# Altium schematic sheet Top.SchDoc
size B; SheetNumber: 1; SheetTotal: 9
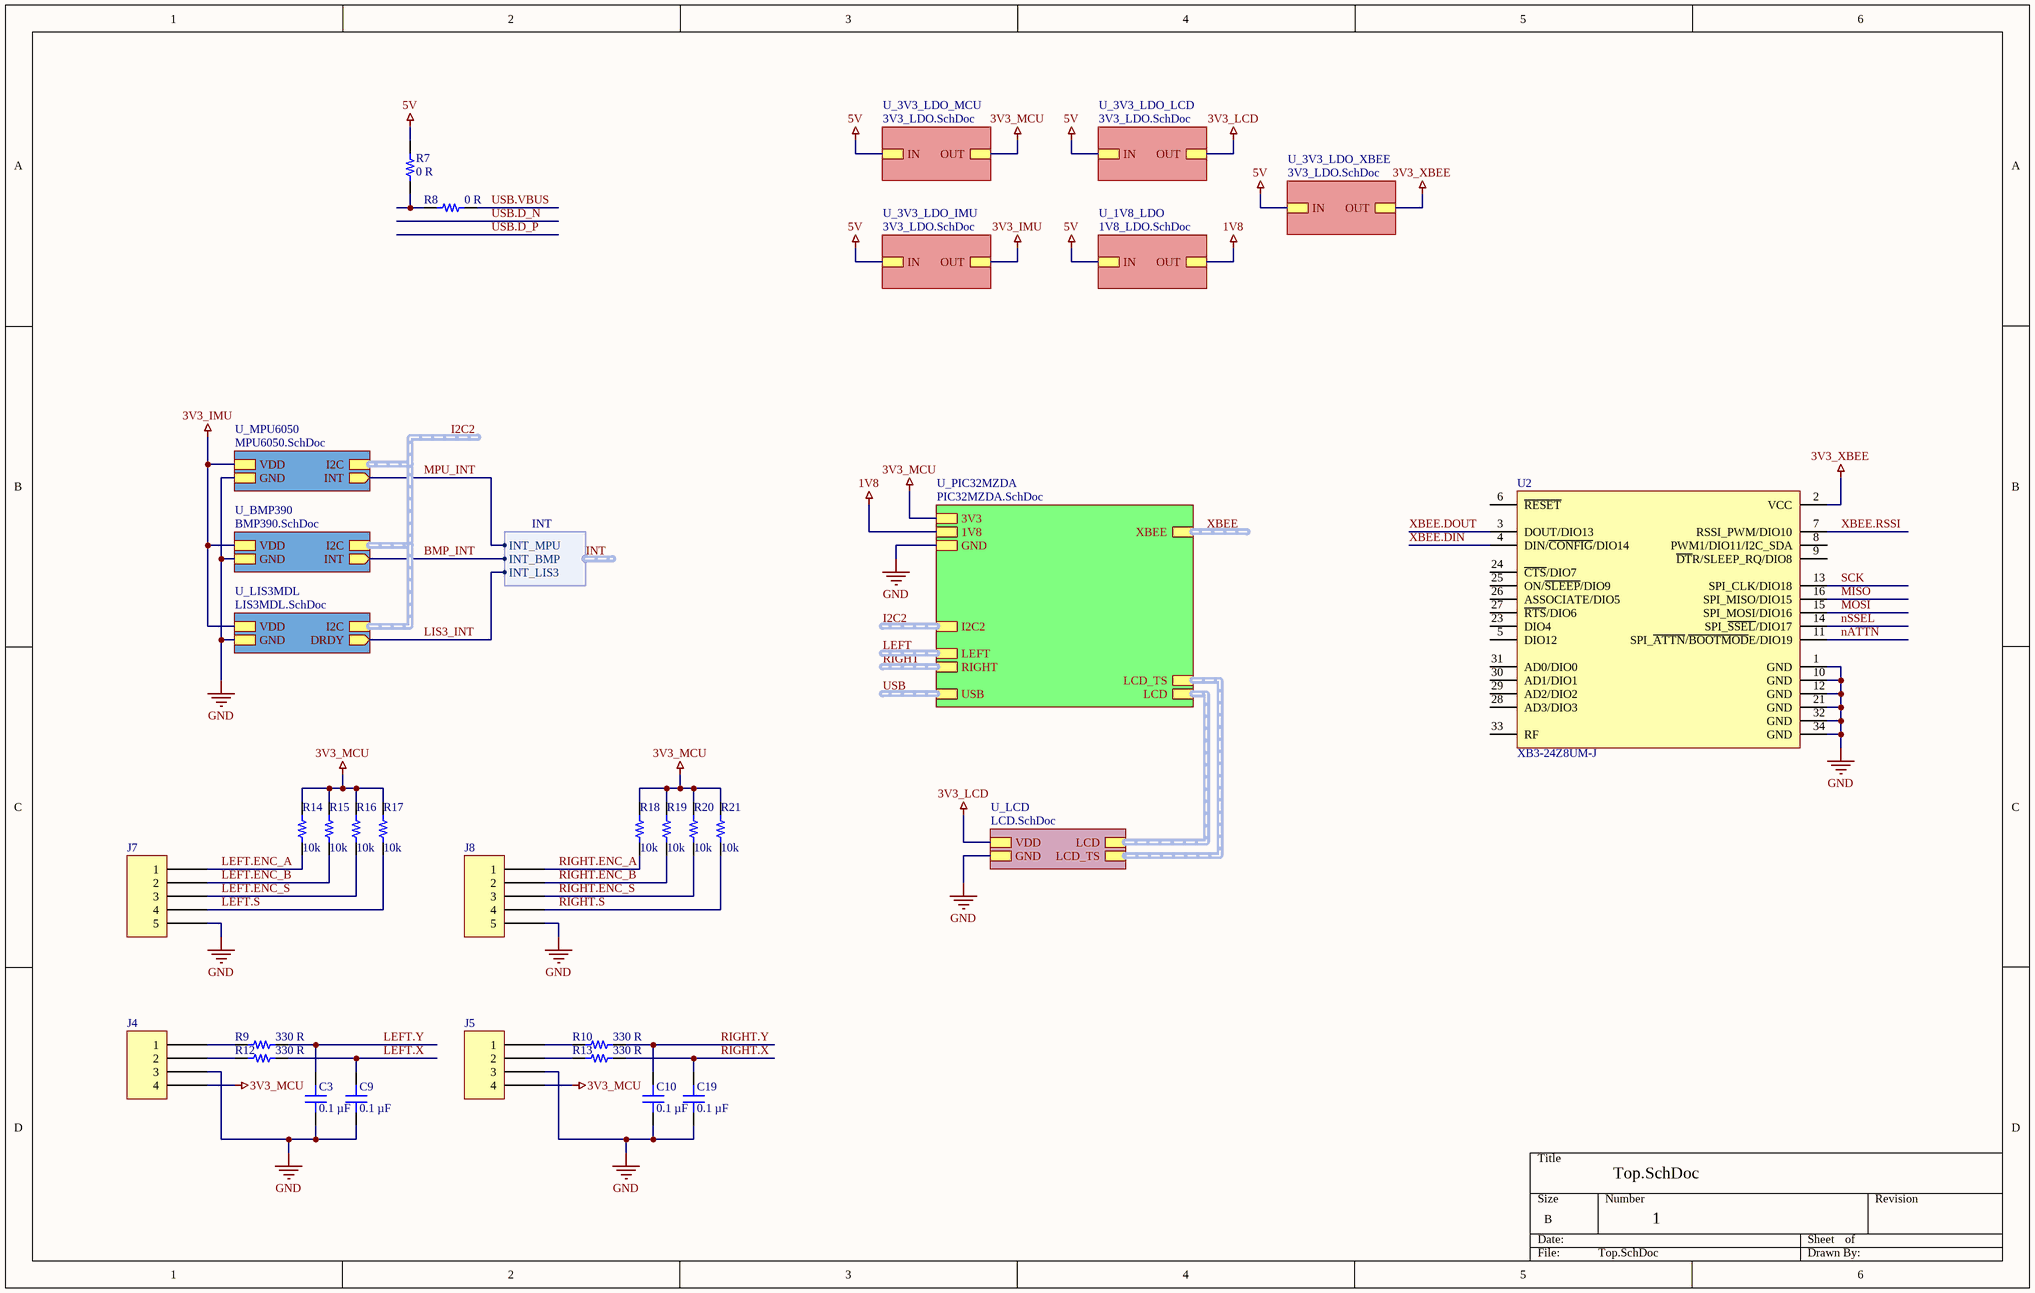
[diagram p0: Top.SchDoc]

## Parts
C3  0.1 µF  [CAP 0402_1005]
C9  0.1 µF  [CAP 0402_1005]
C10  0.1 µF  [CAP 0402_1005]
C19  0.1 µF  [CAP 0402_1005]
J4  BM04B-SRSS-TB(LF)(SN)  [JST BM04B-SRSS-TB]  (value not drawn)
J5  BM04B-SRSS-TB(LF)(SN)  [JST BM04B-SRSS-TB]  (value not drawn)
J7  SM05B-SRSS-TB(LF)(SN)  [JST SM05B-SRSS-TB]  (value not drawn)
J8  SM05B-SRSS-TB(LF)(SN)  [JST SM05B-SRSS-TB]  (value not drawn)
R7  0 R  [RES 0603_1608]
R8  0 R  [RES 0402_1005]
R9  330 R  [RES 0402_1005]
R10  330 R  [RES 0402_1005]
R12  330 R  [RES 0402_1005]
R13  330 R  [RES 0402_1005]
R14  10k  [RES 0402_1005]
R15  10k  [RES 0402_1005]
R16  10k  [RES 0402_1005]
R17  10k  [RES 0402_1005]
R18  10k  [RES 0402_1005]
R19  10k  [RES 0402_1005]
R20  10k  [RES 0402_1005]
R21  10k  [RES 0402_1005]
U2  XB3-24Z8UM-J  [XCVR_XB3-24Z8UM-J]

## Sub-sheets
U_1V8_LDO = 1V8_LDO.SchDoc: OUT, IN
U_3V3_LDO_IMU = 3V3_LDO.SchDoc: OUT, IN
U_3V3_LDO_LCD = 3V3_LDO.SchDoc: OUT, IN
U_3V3_LDO_MCU = 3V3_LDO.SchDoc: OUT, IN
U_3V3_LDO_XBEE = 3V3_LDO.SchDoc: OUT, IN
U_BMP390 = BMP390.SchDoc: VDD, GND, I2C (harness I2C), INT (out)
U_LCD = LCD.SchDoc: VDD, GND, LCD (harness LCD), LCD_TS (harness LCD_TS)
U_LIS3MDL = LIS3MDL.SchDoc: VDD, GND, I2C (harness I2C), DRDY (out)
U_MPU6050 = MPU6050.SchDoc: VDD, GND, I2C (harness I2C), INT (out)
U_PIC32MZDA = PIC32MZDA.SchDoc: 1V8, GND, 3V3, LCD (harness LCD), USB (harness USB), I2C2 (harness I2C), LCD_TS (harness LCD_TS), LEFT (harness INPUT), RIGHT (harness INPUT), XBEE (harness XBEE)

## Harnesses
INT: INT_MPU, INT_BMP, INT_LIS3

## Nets
1V8: sheet U_PIC32MZDA/1V8, sheet U_1V8_LDO/OUT
3V3_IMU: sheet U_MPU6050/VDD, sheet U_LIS3MDL/VDD, sheet U_BMP390/VDD, sheet U_3V3_LDO_IMU/OUT
3V3_LCD: sheet U_LCD/VDD, sheet U_3V3_LDO_LCD/OUT
3V3_MCU: J4.4 J5.4 R14.1 R15.1 R16.1 R17.1 R18.1 R19.1 R20.1 R21.1 ; sheet U_3V3_LDO_MCU/OUT, sheet U_PIC32MZDA/3V3
3V3_XBEE: U2.2(VCC) ; sheet U_3V3_LDO_XBEE/OUT
5V: R7.2 ; sheet U_3V3_LDO_MCU/IN, sheet U_3V3_LDO_LCD/IN, sheet U_1V8_LDO/IN, sheet U_3V3_LDO_IMU/IN, sheet U_3V3_LDO_XBEE/IN
GND: C3.1 C9.1 C10.1 C19.1 J4.3 J5.3 J7.5 J8.5 U2.1(GND) U2.10(GND) U2.12(GND) U2.21(GND) U2.32(GND) U2.34(GND) ; sheet U_PIC32MZDA/GND, sheet U_LCD/GND, sheet U_MPU6050/GND, sheet U_LIS3MDL/GND, sheet U_BMP390/GND
BMP_INT: sheet U_BMP390/INT, harness INT.INT_BMP
LEFT.ENC_A: J7.1 R14.2
LEFT.ENC_B: J7.2 R15.2
LEFT.ENC_S: J7.3 R16.2
LEFT.S: J7.4 R17.2
LEFT.X: C9.2 R12.1
LEFT.Y: C3.2 R9.1
LIS3_INT: sheet U_LIS3MDL/DRDY, harness INT.INT_LIS3  [project net INT.INT_LIS3]
MISO: U2.16(SPI_MISO/DIO15)
MOSI: U2.15(SPI_MOSI/DIO16)
MPU_INT: sheet U_MPU6050/INT, harness INT.INT_MPU  [project net INT.INT_MPU]
nATTN: U2.11(SPI_~{ATTN}/~{BOOTMOD}E/DIO19)
nSSEL: U2.14(SPI_~{SSEL}/DIO17)
RIGHT.ENC_A: J8.1 R18.2
RIGHT.ENC_B: J8.2 R19.2
RIGHT.ENC_S: J8.3 R20.2
RIGHT.S: J8.4 R21.2
RIGHT.X: C19.2 R13.1
RIGHT.Y: C10.2 R10.1
SCK: U2.13(SPI_CLK/DIO18)
USB.VBUS: R8.1
XBEE.DIN: U2.4(DIN/~{CONFIG}/DIO14)
XBEE.DOUT: U2.3(DOUT/DIO13)
XBEE.RSSI: U2.7(RSSI_PWM/DIO10)
NetJ4_1: J4.1 R9.2
NetJ4_2: J4.2 R12.2
NetJ5_1: J5.1 R10.2
NetJ5_2: J5.2 R13.2
NetR7_1: R7.1 R8.2

Not connected (* = marked no-connect by the designer): U2 5(DIO12) 6(~{RESET}) 8(PWM1/DIO11/I2C_SDA) 9(~{DT}R/SLEEP_RQ/DIO8) 23(DIO4) 24(~{CTS}/DIO7) 25(ON/~{SLEEP}/DIO9) 26(ASSOCIATE/DIO5) 27(~{RTS}/DIO6) 28(AD3/DIO3) 29(AD2/DIO2) 30(AD1/DIO1) 31(AD0/DIO0) 33(RF)

## Buses and harness runs
harness I2C2 = sheet U_BMP390/I2C = sheet U_LIS3MDL/I2C = sheet U_MPU6050/I2C
harness I2C2 = sheet U_PIC32MZDA/I2C2
harness LEFT = sheet U_PIC32MZDA/LEFT
harness RIGHT = sheet U_PIC32MZDA/RIGHT
harness sheet U_LCD/LCD = sheet U_PIC32MZDA/LCD
harness sheet U_LCD/LCD_TS = sheet U_PIC32MZDA/LCD_TS
harness USB = sheet U_PIC32MZDA/USB
harness XBEE = sheet U_PIC32MZDA/XBEE

## Library data of the parts
C3 C9 C10 C19 = C0402C104K4RACAUTO: CAP CER 0.1UF 16V X7R 0402; manufacturer: KEMET; Tolerance: ±10%; Part Number: C0402C104K4RACAUTO; Value: 0.1 µF; Applications: Automotive, Bypass, Decoupling; Capacitance: 0.1 µF; componentlink1description: Datasheet; componentlink1url: https://api.kemet.com/component-edge/download/specsheet/C0402C104K4RACAUTO.pdf; componentlink2description: DigiKey Link; componentlink2url: https://www.digikey.com/en/products/detail/kemet/C0402C104K4RACAUTO/3314827; Device Package: 0402 (1005 Metric); lastupdated: 8/14/2022 9:05:51 PM; Lifecycle Status: Active; Minimum Order: 1; Mounting Type: Surface Mount, MLCC; Operating Temperature: -55°C ~ 125°C; Package / Case: 0402 (1005 Metric); packaging: TapeAndReel; partid: 3024; Part Status: Active; price: 0.01; Ratings: AEC-Q200; series: SMD Auto X7R; Size / Dimension: 0.039" L x 0.020" W (1.00mm x 0.50mm); Supplier 1: DigiKey; Supplier Part Number 1: 399-6828-1-ND; Temperature Coefficient: X7R; Thickness (Max): 0.022" (0.55mm); Voltage - Rated: 16V
J4 J5 = BM04B-SRSS-TB(LF)(SN): CONN HEADER SMD 4POS 1MM; Manufacturer: JST Sales America Inc.; Current Rating (Amps): 0.7A; Material Flammability Rating: UL94 V-0; Number of Positions: 4; Number of Positions Loaded: All; Pitch - Mating: 0.039" (1.00mm); Row Spacing - Mating: -25°C ~ 85°C; Shrouding: Shrouded - 4 Wall; Style: Board to Cable/Wire; Voltage Rating: 50V; Part Number: BM04B-SRSS-TB(LF)(SN); ComponentLink1Description: Datasheet; ComponentLink1URL: http://www.jst-mfg.com/product/pdf/eng/eSH.pdf; ComponentLink2Description: DigiKey Link; ComponentLink2URL: http://digikey.com/product-detail/en/jst-sales-america-inc/BM04B-SRSS-TB-LF-SN/455-1790-1-ND/926861; Connector Type: Header; Contact Finish - Mating: Tin; Contact Finish - Post: Tin; Contact Material: Copper Alloy; Contact Shape: Square; Contact Type: Male Pin; Fastening Type: Push-Pull; Features: Solder Retention; Insulation Color: Natural; Insulation Height: 0.167" (4.25mm); Insulation Material: Polyamide (PA), Nylon; LastUpdated: 8/24/2020 1:45:53 PM; Lifecycle Status: Active; Minimum Order: 1; Mounting Type: Surface Mount; Number of Rows: 1; Operating Temperature: -25°C ~ 85°C; Packaging: TapeAndReel; PartId: 16; Part Status: Active; Price: 0.29; Series: SR; Supplier 1: DigiKey; Supplier Part Number 1: 455-1790-1-ND; Termination: Solder
J7 J8 = SM05B-SRSS-TB(LF)(SN): CONN HEADER SMD R/A 5POS 1MM; Manufacturer: JST Sales America Inc.; Current Rating (Amps): 0.7A; Material Flammability Rating: UL94 V-0; Number of Positions: 5; Number of Positions Loaded: All; Pitch - Mating: 0.039" (1.00mm); Shrouding: Shrouded - 4 Wall; Style: Board to Cable/Wire; Voltage Rating: 50V; Part Number: SM05B-SRSS-TB(LF)(SN); ComponentLink1Description: Datasheet; ComponentLink1URL: http://www.jst-mfg.com/product/pdf/eng/eSH.pdf; ComponentLink2Description: DigiKey Link; ComponentLink2URL: http://digikey.com/product-detail/en/jst-sales-america-inc/SM05B-SRSS-TB-LF-SN/455-1805-1-ND/926876; Connector Type: Header; Contact Finish - Mating: Tin; Contact Finish - Post: Tin; Contact Material: Copper Alloy; Contact Shape: Square; Contact Type: Male Pin; Fastening Type: Push-Pull; Features: Solder Retention; Insulation Color: Natural; Insulation Height: 0.114" (2.90mm); Insulation Material: Polyamide (PA), Nylon; LastUpdated: 1/12/2020 11:42:04 PM; Lifecycle Status: Active; Minimum Order: 1; Mounting Type: Surface Mount, Right Angle; Number of Rows: 1; Operating Temperature: -25°C ~ 85°C; Packaging: TapeAndReel; PartId: 63; Part Status: Active; Price: 0.32; Series: SR; Supplier 1: DigiKey; Supplier Part Number 1: 455-1805-1-ND; Termination: Solder
R7 = RNCS0603BKE10K0: RES 10K OHM 0.1% 1/16W 0603; Manufacturer: Stackpole Electronics Inc; Power (Watts): 0.063W, 1/16W; Resistance: 10 kOhms; Temperature Coefficient: ±25ppm/°C; Part Number: RNCS0603BKE10K0; Value: 0 R; ComponentLink1Description: Datasheet; ComponentLink1URL: https://www.seielect.com/catalog/sei-rncs_rnch.pdf; ComponentLink2Description: DigiKey Link; ComponentLink2URL: https://www.digikey.com/en/products/detail/stackpole-electronics-inc/RNCS0603BKE10K0/1708836; Composition: Thin Film; Device Package: 0603 (1608 Metric); Features: Anti-Corrosive, Automotive AEC-Q200, Moisture Resistant; Height - Seated (Max): 0.022" (0.55mm); LastUpdated: 9/19/2022 1:22:34 PM; Lifecycle Status: Active; Minimum Order: 1; Number of Terminations: 2; Operating Temperature: -55°C ~ 155°C; Package / Case: 0603 (1608 Metric); Packaging: TapeAndReel; PartId: 4838; Part Status: Active; Price: 0.07; Ratings: AEC-Q200; Series: RNCS; Size / Dimension: 0.061" L x 0.031" W (1.55mm x 0.80mm); Supplier 1: DigiKey; Supplier Part Number 1: RNCS0603BKE10K0CT-ND; Supplier Device Package: 0603; Tolerance: ±0.1%
R8-R10 R12-R21 = CRCW0402330RJNEDC: RES 330 OHM 5% 1/16W 0402; Manufacturer: Vishay Dale; Power (Watts): 0.063W, 1/16W; Resistance: 330 Ohms; Temperature Coefficient: ±200ppm/°C; Part Number: CRCW0402330RJNEDC; ComponentLink1Description: Datasheet; ComponentLink1URL: http://www.vishay.com/docs/28773/crcwce3.pdf; ComponentLink2Description: DigiKey Link; ComponentLink2URL: https://www.digikey.com/en/products/detail/vishay-dale/CRCW0402330RJNEDC/7928545; Composition: Thick Film; Device Package: 0402 (1005 Metric); Height - Seated (Max): 0.014" (0.35mm); LastUpdated: 8/14/2022 9:23:31 PM; Lifecycle Status: Active; Minimum Order: 1; Number of Terminations: 2; Operating Temperature: -55°C ~ 155°C; Package / Case: 0402 (1005 Metric); Packaging: CutTape; PartId: 15989; Part Status: Active; Price: 0.01; Series: CRCW-C; Size / Dimension: 0.039" L x 0.020" W (1.00mm x 0.50mm); Supplier 1: DigiKey; Supplier Part Number 1: 541-4123-1-ND; Supplier Device Package: 0402; Tolerance: ±5%
  R8: Value: 0 R
  R9 R10 R12 R13: Value: 330 R
  R14-R21: Value: 10k
U2 = XB3-24Z8UM-J: 802.15.4 Zigbee Transceiver Module 2.4GHz Antenna Not Included, U.FL Surface Mount; MF: Digi International; Availability: Unavailable; MP: XB3-24Z8UM-J; Value: *; SnapEDA_Link: https://www.snapeda.com/parts/XB3-24Z8UM-J/Digi%20International/view-part/2762908/?ref=snap; Price: None; Package: SMD-34 Digi International